# Altium project suns_wifi_egse.PrjPcb
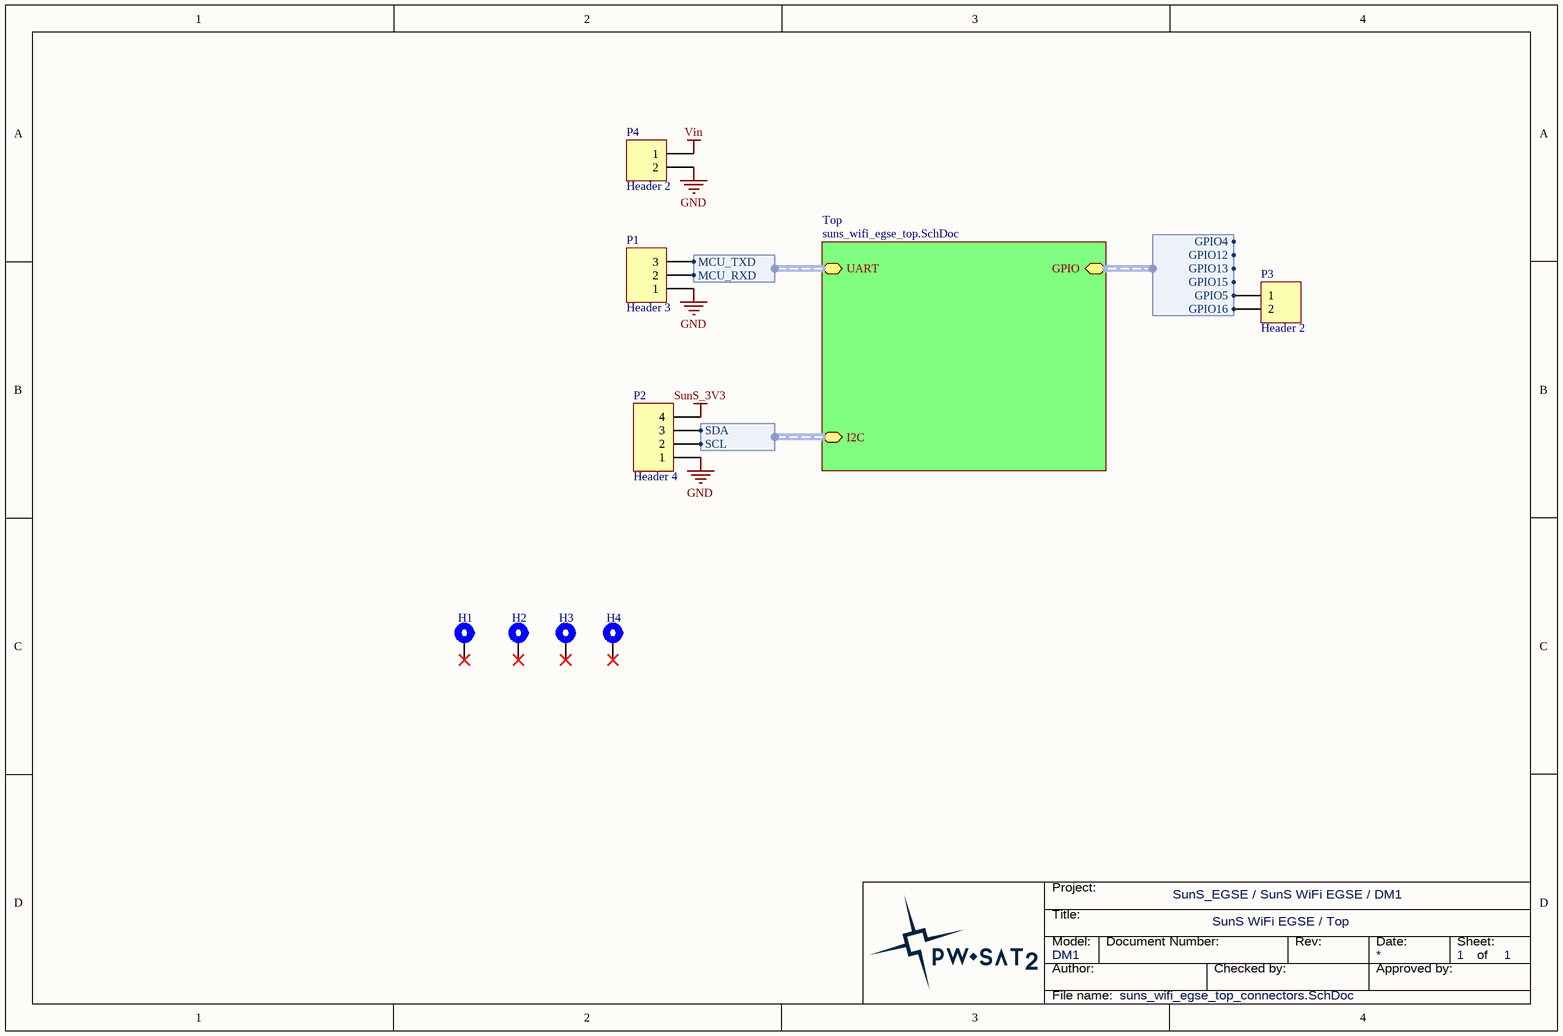
[diagram p0: suns_wifi_egse_top_connectors.SchDoc]
ApprovedBy_Name: (not approved); Author_Name: Micha³ Gumiela; CheckedBy_Name: (not checked); Equipment: SunS WiFi EGSE; Model: DM1; PCB_Author: Micha³ Gumiela; PCB_CheckedBy: (not checked); PCB_DocName: SunS WiFi EGSE PCB; PCB_DocNo: PWSat2-PLD-DW-xxx; PCB_Id: Gyro Daughter PCB; PCB_Revision: 3; Project_FullName: PW-Sat2; Project_Id: SunS WiFi EGSE; Project_ShortName: SunS_EGSE; Schematics_DocName: SunS WiFi EGSE; Schematics_DocNo: PWSat2-PLD-DW-xxx; Schematics_Revision: 1; Subsystem: SunS
4 sheets, 30 parts. Net scope: hierarchical (ports join the sheet entries above them; power ports are global).
Board file: suns_wifi_egse.PcbDoc
Sheets:
  suns_wifi_egse_top_connectors.SchDoc
    Top = suns_wifi_egse_top.SchDoc
      ESP8266 = suns_wifi_egse_esp8266.SchDoc
      EPS = suns_wifi_egse_power_supply.SchDoc

## Sheet suns_wifi_egse_top_connectors.SchDoc: Top
size A4; ApprovedBy: (not approved); CheckedBy: (not checked); Author: Micha³ Gumiela; DocumentNumber: PWSat2-PLD-DW-xxx; Revision: 1; SheetNumber: 1; SheetTotal: 1; Model: DM1

### Parts
H1  Mounting Hole  [PC-104_PcbMntHole_M3]  (value not drawn)
H2  Mounting Hole  [PC-104_PcbMntHole_M3]  (value not drawn)
H3  Mounting Hole  [PC-104_PcbMntHole_M3]  (value not drawn)
H4  Mounting Hole  [PC-104_PcbMntHole_M3]  (value not drawn)
P1  Header 3  [HEADER1X3H Male]
P2  Header 4  [HEADER 1X4H Male]
P3  Header 2  [HEADER 1X2H Male]
P4  Header 2  [HEADER 1X2H Male]

### Sub-sheets
Top = suns_wifi_egse_top.SchDoc: UART (harness UART), I2C (harness I2C), GPIO (harness GPIO)

### Harnesses
UART: MCU_RXD, MCU_TXD
I2C: SCL, SDA
GPIO: GPIO4, GPIO5, GPIO12, GPIO13, GPIO15, GPIO16

### Nets
GND: P1.1 P2.1 P4.2
SunS_3V3: P2.4
Vin: P4.1
IO5: P3.1 ; sheet Top/GPIO.GPIO5
IO16: P3.2 ; sheet Top/GPIO.GPIO16
SCL: P2.2 ; sheet Top/I2C.SCL
SDA: P2.3 ; sheet Top/I2C.SDA
NetIC1_11: P1.2 ; sheet Top/UART.MCU_RXD
NetIC1_12: P1.3 ; sheet Top/UART.MCU_TXD

Not connected (* = marked no-connect by the designer): H1 1*; H2 1*; H3 1*; H4 1*

### Notes on the sheet
- Title:
- Project:
- Author:
- Model:
- Document Number:
- Checked by:
- Rev:
- Date:
- Approved by:
- Sheet:
- of
- File name:

### Library data of the parts
H1-H4 = MntHole: PCB Mounting Hole; Value: Mounting Hole
P1 = Header 3: Header, 3-Pin; LatestRevisionDate: 17-Jul-2002; LatestRevisionNote: Re-released for DXP Platform.; Publisher: Altium Limited
P2 = Header 4: Header, 4-Pin; LatestRevisionDate: 17-Jul-2002; LatestRevisionNote: Re-released for DXP Platform.; Publisher: Altium Limited
P3 P4 = Header 2: Header, 2-Pin; LatestRevisionDate: 17-Jul-2002; LatestRevisionNote: Re-released for DXP Platform.; Publisher: Altium Limited

## Sheet suns_wifi_egse_top.SchDoc: Top
size A4; ApprovedBy: (not approved); CheckedBy: (not checked); Author: Micha³ Gumiela; DocumentNumber: PWSat2-PLD-DW-xxx; Revision: 1; SheetNumber: 1; SheetTotal: 1; Model: DM1
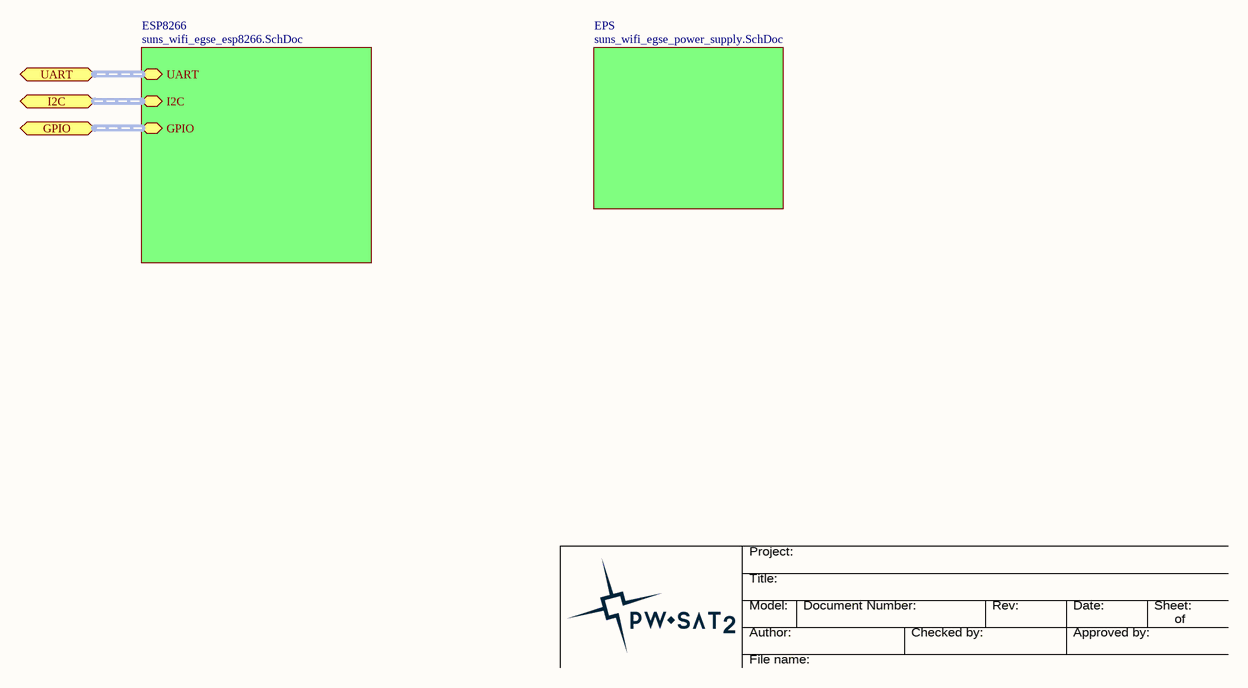
[diagram p1: suns_wifi_egse_top.SchDoc]

### Sub-sheets
EPS = suns_wifi_egse_power_supply.SchDoc: no entries
ESP8266 = suns_wifi_egse_esp8266.SchDoc: UART (harness UART), I2C (harness I2C), GPIO (harness GPIO)

### Ports
GPIO (harness GPIO), I2C (harness I2C), UART (harness UART)

### Buses and harness runs
harness port GPIO = sheet ESP8266/GPIO
harness port I2C = sheet ESP8266/I2C
harness port UART = sheet ESP8266/UART

### Notes on the sheet
- Title:
- Project:
- Author:
- Model:
- Document Number:
- Checked by:
- Rev:
- Date:
- Approved by:
- Sheet:
- of
- File name:

## Sheet suns_wifi_egse_esp8266.SchDoc: Top
size A4; ApprovedBy: (not approved); CheckedBy: (not checked); Author: Micha³ Gumiela; DocumentNumber: PWSat2-PLD-DW-xxx; Revision: 1; SheetNumber: 1; SheetTotal: 1; Model: DM1
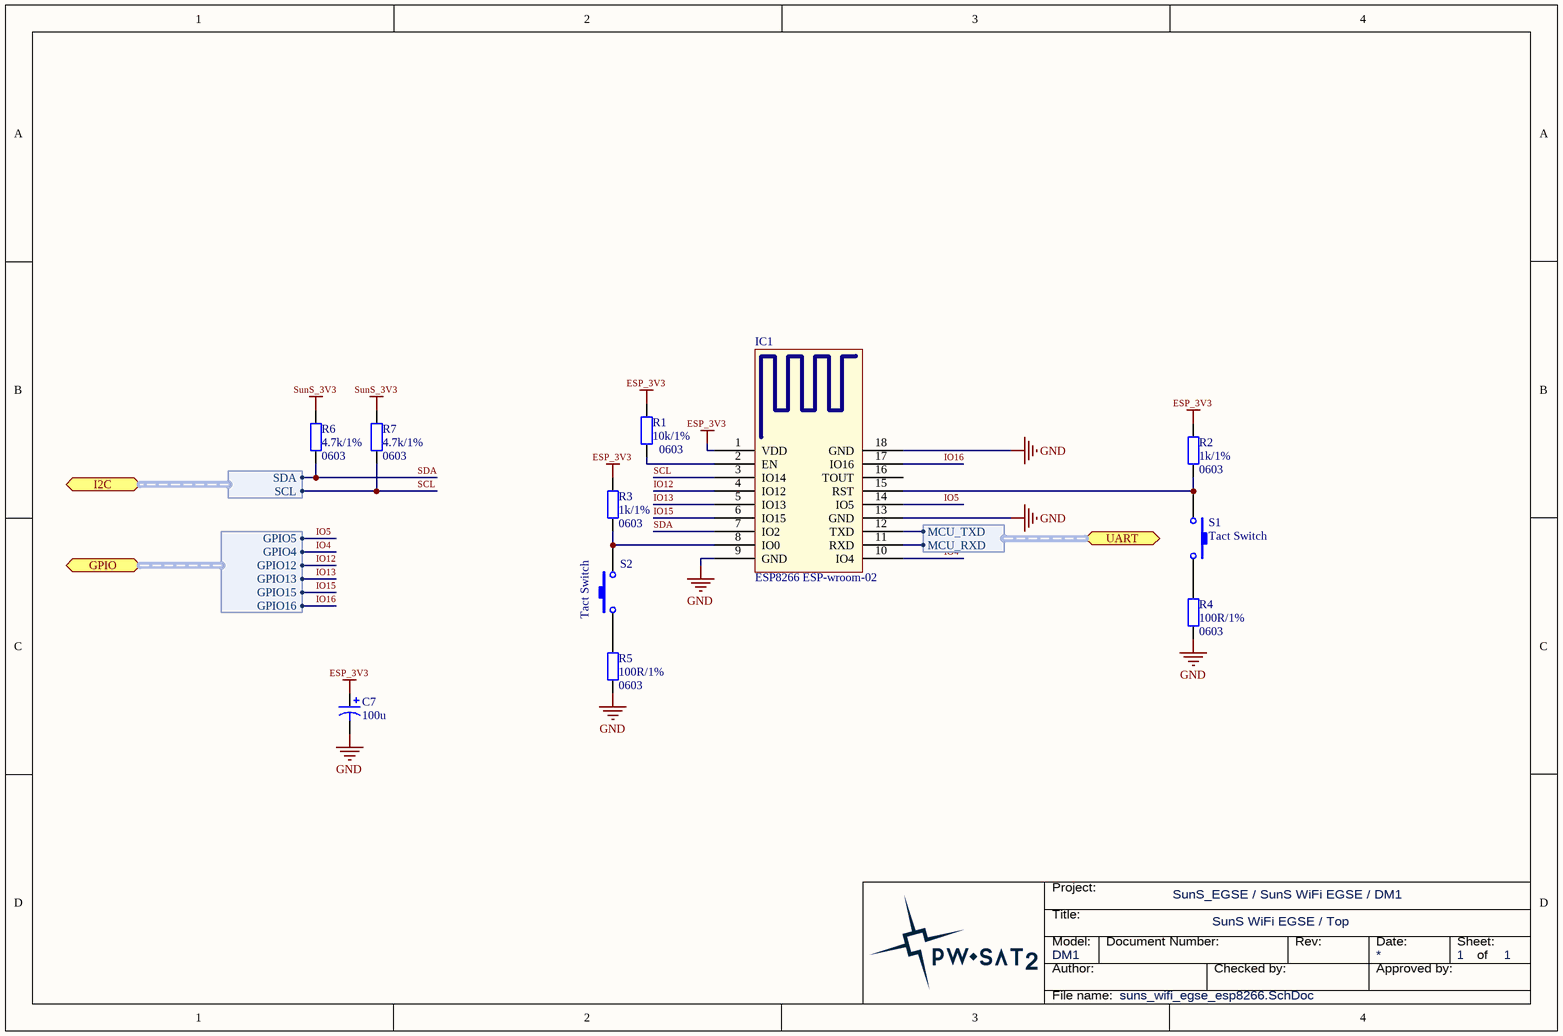
[diagram p2: suns_wifi_egse_esp8266.SchDoc]

### Parts
C7  100u  [CAP_ELEC_6.3x4.2]
IC1  ESP8266 ESP-wroom-02  [ESP8266 ESP-wroom-02]
R1  Package: 0603  [SMD_Resistor_0603]  (hidden comment: 10k/1%)
R2  Package: 0603  [SMD_Resistor_0603]  (hidden comment: 1k/1%)
R3  Package: 0603  [SMD_Resistor_0603]  (hidden comment: 1k/1%)
R4  Package: 0603  [SMD_Resistor_0603]  (hidden comment: 100R/1%)
R5  Package: 0603  [SMD_Resistor_0603]  (hidden comment: 100R/1%)
R6  Package: 0603  [SMD_Resistor_0603]  (hidden comment: 4.7k/1%)
R7  Package: 0603  [SMD_Resistor_0603]  (hidden comment: 4.7k/1%)
S1  Tact Switch  [Tact Switch 3x6]
S2  Tact Switch  [Tact Switch 3x6]

### Ports
GPIO (harness GPIO), I2C (harness I2C), UART (harness UART)

### Harnesses
UART: MCU_RXD, MCU_TXD
I2C: SCL, SDA
GPIO: GPIO4, GPIO5, GPIO12, GPIO13, GPIO15, GPIO16

### Nets
ESP_3V3: C7.1 IC1.1(VDD) R1.2 R2.2 R3.2
GND: C7.2 IC1.9(GND) IC1.13(GND) IC1.18(GND) R4.1 R5.1
SunS_3V3: R6.1 R7.1
IO4: IC1.10(IO4) ; port GPIO.GPIO4
IO5: IC1.14(IO5) ; port GPIO.GPIO5
IO12: IC1.4(IO12) ; port GPIO.GPIO12
IO13: IC1.5(IO13) ; port GPIO.GPIO13
IO15: IC1.6(IO15) ; port GPIO.GPIO15
IO16: IC1.17(IO16) ; port GPIO.GPIO16
SCL: IC1.3(IO14) R7.2 ; port I2C.SCL
SDA: IC1.7(IO2) R6.2 ; port I2C.SDA
NetIC1_2: IC1.2(EN) R1.1
NetIC1_8: IC1.8(IO0) R3.1 S2.2
NetIC1_11: IC1.11(RXD) ; port UART.MCU_RXD
NetIC1_12: IC1.12(TXD) ; port UART.MCU_TXD
NetIC1_15: IC1.15(RST) R2.1 S1.2
NetR4_2: R4.2 S1.1
NetR5_2: R5.2 S2.1

Not connected (* = marked no-connect by the designer): IC1 16(TOUT)

### Notes on the sheet
- Title:
- Project:
- Author:
- Model:
- Document Number:
- Checked by:
- Rev:
- Date:
- Approved by:
- Sheet:
- of
- File name:

### Library data of the parts
C7 = Cap Pol: Polarized Capacitor; value: 100u; ComponentLink1Description: Datasheet
R1-R5 = CRCW06031K00FKxxxx: 1k/1% Vishay CRCW 0603 Resistor. 100mW, 100ppm, 75V.; Manufacturer: Vishay; ManufacturerPartNumber: CRCW06031K00FKxxxx
  R1: Value: 10k/1%
  R2 R3: Value: 1k/1%
  R4 R5: Value: 100R/1%
R6 R7 = CRCW06034K70FKxxxx: 4.7k/1% Vishay CRCW 0603 Resistor. 100mW, 100ppm, 75V.; Manufacturer: Vishay; ManufactuerPartNumber: CRCW06034K70FKxxxx; Value: 4.7k/1%
S1 S2 = TactSwitch: Supplier 1: Farnell

## Sheet suns_wifi_egse_power_supply.SchDoc: Top
size A4; ApprovedBy: (not approved); CheckedBy: (not checked); Author: Micha³ Gumiela; DocumentNumber: PWSat2-PLD-DW-xxx; Revision: 1; SheetNumber: 1; SheetTotal: 1; Model: DM1
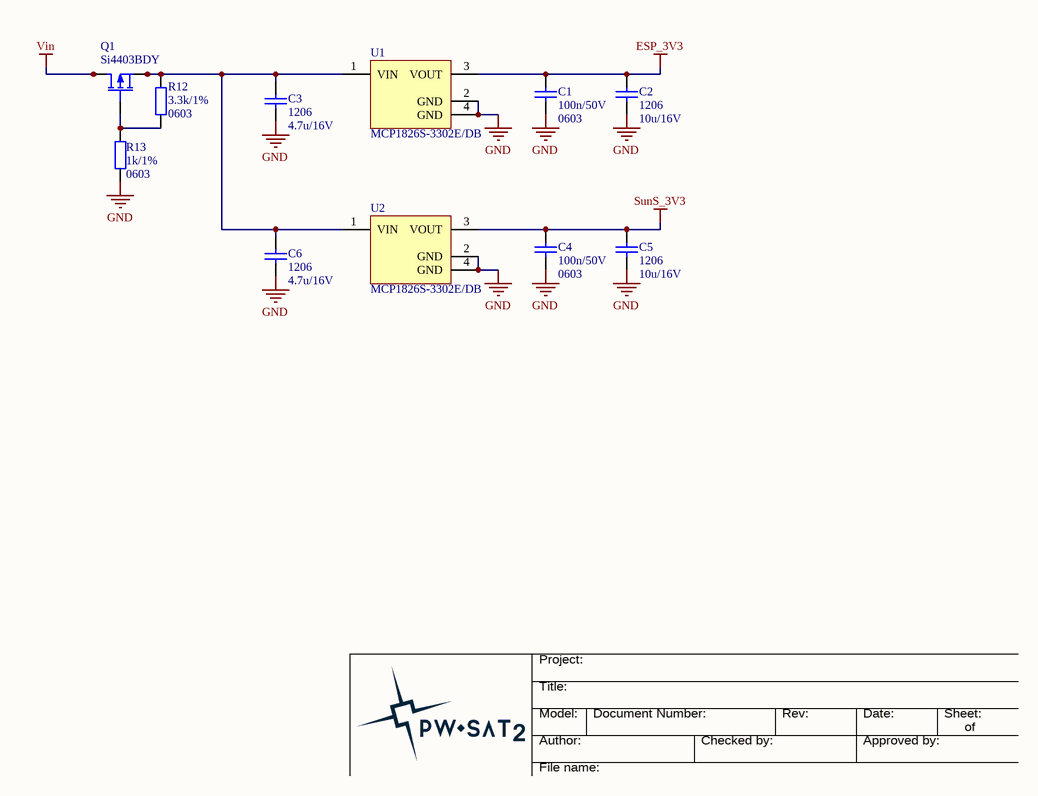
[diagram p3: suns_wifi_egse_power_supply.SchDoc]

### Parts
C1  Package: 0603  [SMD_Capacitor_0603]  (hidden comment: 100n/50V)
C2  Packge: 1206  [SMD_Capacitor_1206]  (hidden comment: 10u/16V)
C3  Packge: 1206  [SMD_Capacitor_1206]  (hidden comment: 4.7u/16V)
C4  Package: 0603  [SMD_Capacitor_0603]  (hidden comment: 100n/50V)
C5  Packge: 1206  [SMD_Capacitor_1206]  (hidden comment: 10u/16V)
C6  Packge: 1206  [SMD_Capacitor_1206]  (hidden comment: 4.7u/16V)
Q1  Si4403BDY  [SOIC-8_M]
R12  Package: 0603  [SMD_Resistor_0603]  (hidden comment: 3.3k/1%)
R13  Package: 0603  [SMD_Resistor_0603]  (hidden comment: 1k/1%)
U1  MCP1826S-3302E/DB  [SOT-223-DB3_M]
U2  MCP1826S-3302E/DB  [SOT-223-DB3_M]

### Nets
ESP_3V3: C1.1 C2.1 U1.3(VOUT)
GND: C1.2 C2.2 C3.2 C4.2 C5.2 C6.2 R13.2 U1.2(GND) U1.4(GND) U2.2(GND) U2.4(GND)
SunS_3V3: C4.1 C5.1 U2.3(VOUT)
Vin: Q1.5(D) Q1.6(D) Q1.7(D) Q1.8(D)
NetC3_1: C3.1 C6.1 Q1.1(S) Q1.2(S) Q1.3(S) R12.1 U1.1(VIN) U2.1(VIN)
NetQ1_4: Q1.4(G) R12.2 R13.1

### Notes on the sheet
- Title:
- Project:
- Author:
- Model:
- Document Number:
- Checked by:
- Rev:
- Date:
- Approved by:
- Sheet:
- of
- File name:

### Library data of the parts
C1 C4 = Cer_C0603T104K5RALTU: Ceramic Cap Kemet COTS 100n/50V X7R 0603; Manufacturer: Kemet; ManufacturerPartNumber: C0603T104K5RALTU; Value: 100n/50V
C2 C3 C5 C6 = Cer_C1206T106K4RACTU: Ceramic Cap Kemet COTS 10u/16V X7R 1206; ManufacturerPartNumber: C1206T106K4RACTU; Manufacturer: Kemet
  C2 C5: Value: 10u/16V
  C3 C6: Value: 4.7u/16V
Q1 = Si4403BDY: P-Channel 1.8 V (G-S) MOSFET; Manufacturer Part Number: Si4403BDY; value: Si4403BDY
R12 R13 = CRCW06031K00FKxxxx: as R1 on sheet suns_wifi_egse_esp8266; Manufacturer: Vishay; ManufacturerPartNumber: CRCW06031K00FKxxxx
  R12: Value: 3.3k/1%
  R13: Value: 1k/1%
U1 U2 = MCP1826S-3302E/DB: 1000 mA, Low Voltage, Low Quiescent Current LDO Regulator, 3-Pin SOT-223, Extended Temperature; Manufacturer: Microchip; DatasheetVersion: revA, Aug-2007; PackageVersion: revBB, Aug-2009; PackageReference: SOT-223-DB3; PackageDescription: 3-Lead Plastic Small Outline Transistor (DB) [SOT-223]; Supplier 1: Digi-Key; Supplier Part Number 1: MCP1826S-3302E/DB-ND; Supplier 2: Newark; Supplier Part Number 2: 27M0037; Supplier 3: Mouser; Supplier Part Number 3: 579-MCP1826S-3302EDB; Mounting Technology: Surface Mount; PartNumber: MCP1826S-3302E/DB; ComponentLink1Description: Manufacturer URL; ComponentLink1URL: http://www.microchip.com/; ComponentLink2Description: Datasheet; ComponentLink2URL: http://ww1.microchip.com/downloads/en/DeviceDoc/22057a.pdf; ComponentLink3Description: Package Specification; ComponentLink3URL: http://www.microchip.com/stellent/groups/techpub_sg/documents/packagingspec/en012702.pdf

## Nets that join several sheets
ESP_3V3: suns_wifi_egse_esp8266 (5 pins), suns_wifi_egse_power_supply (C1.1 C2.1 U1.3)
GND: suns_wifi_egse_top_connectors (P1.1 P2.1 P4.2), suns_wifi_egse_esp8266 (6 pins), suns_wifi_egse_power_supply (11 pins)
SunS_3V3: suns_wifi_egse_top_connectors (P2.4), suns_wifi_egse_esp8266 (R6.1 R7.1), suns_wifi_egse_power_supply (C4.1 C5.1 U2.3)
Vin: suns_wifi_egse_top_connectors (P4.1), suns_wifi_egse_power_supply (Q1.5 Q1.6 Q1.7 Q1.8)
IO5: suns_wifi_egse_top_connectors (P3.1), suns_wifi_egse_esp8266 (IC1.14)
IO16: suns_wifi_egse_top_connectors (P3.2), suns_wifi_egse_esp8266 (IC1.17)
NetIC1_11: suns_wifi_egse_top_connectors (P1.2), suns_wifi_egse_esp8266 (IC1.11)
NetIC1_12: suns_wifi_egse_top_connectors (P1.3), suns_wifi_egse_esp8266 (IC1.12)
SCL: suns_wifi_egse_top_connectors (P2.2), suns_wifi_egse_esp8266 (IC1.3 R7.2)
SDA: suns_wifi_egse_top_connectors (P2.3), suns_wifi_egse_esp8266 (IC1.7 R6.2)